# Altium schematic sheet Dashboard.SchDoc
size A; DocumentNumber: 10; SheetNumber: 10; SheetTotal: 12
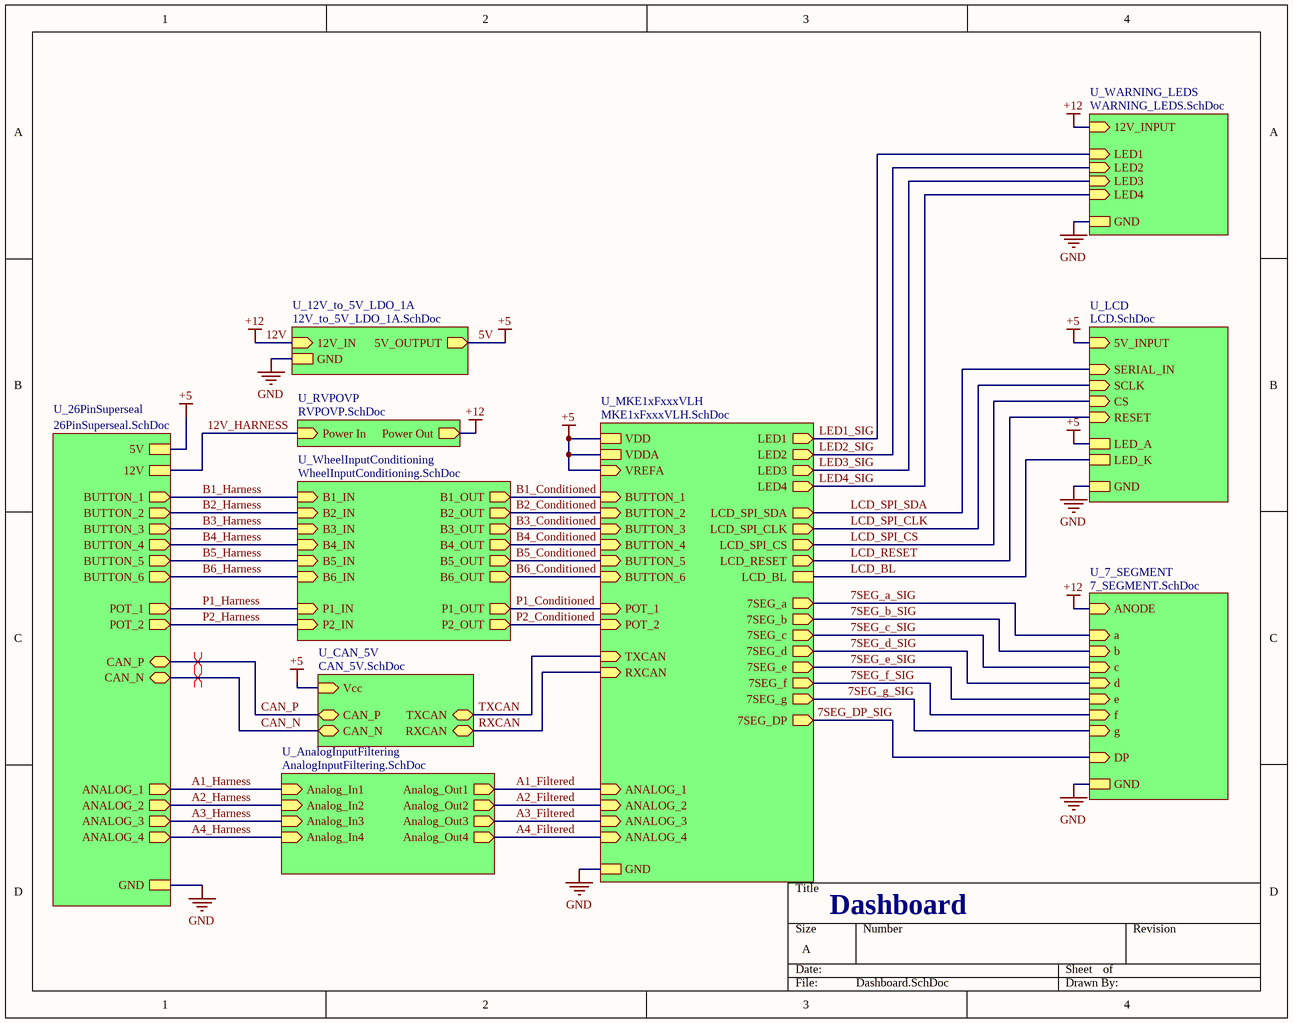
[diagram p0: Dashboard.SchDoc]

## Sub-sheets
U_7_SEGMENT = 7_SEGMENT.SchDoc: GND, DP (in), ANODE (in), g (in), e (in), f (in), b (in), a (in), d (in), c (in)
U_12V_to_5V_LDO_1A = 12V_to_5V_LDO_1A.SchDoc: 12V_IN (in), GND, 5V_OUTPUT (out)
U_26PinSuperseal = 26PinSuperseal.SchDoc: GND, CAN_P (bidir), 12V, POT_2 (out), BUTTON_1 (out), BUTTON_2 (out), BUTTON_3 (out), POT_1 (out), BUTTON_4 (out), CAN_N (bidir), 5V, BUTTON_6 (out), BUTTON_5 (out), ANALOG_3 (out), ANALOG_1 (out), ANALOG_2 (out), ANALOG_4 (out)
U_AnalogInputFiltering = AnalogInputFiltering.SchDoc: Analog_In1 (in), Analog_In2 (in), Analog_In3 (in), Analog_In4 (in), Analog_Out1 (out), Analog_Out2 (out), Analog_Out3 (out), Analog_Out4 (out)
U_CAN_5V = CAN_5V.SchDoc: Vcc (in), CAN_N (bidir), CAN_P (bidir), TXCAN (bidir), RXCAN (bidir)
U_LCD = LCD.SchDoc: 5V_INPUT (in), GND, LED_A, LED_K, SCLK (in), CS (in), RESET (in), SERIAL_IN (in)
U_MKE1xFxxxVLH = MKE1xFxxxVLH.SchDoc: VDD, VDDA, VREFA (in), GND, POT_1 (in), BUTTON_4 (in), RXCAN (in), BUTTON_1 (in), BUTTON_2 (in), LED1 (out), TXCAN (in), LED4 (out), LED3 (out), LED2 (out), BUTTON_3 (in), POT_2 (in), LCD_RESET (out), LCD_SPI_CS (out), LCD_SPI_CLK (out), LCD_SPI_SDA (out), 7SEG_a (out), 7SEG_DP (out), 7SEG_e (out), 7SEG_f (out), 7SEG_d (out), 7SEG_g (out), 7SEG_c (out), 7SEG_b (out), LCD_BL, BUTTON_5 (in), BUTTON_6 (in), ANALOG_3 (in), ANALOG_1 (in), ANALOG_2 (in), ANALOG_4 (in)
U_RVPOVP = RVPOVP.SchDoc: Power Out (out), Power In (in)
U_WARNING_LEDS = WARNING_LEDS.SchDoc: GND, 12V_INPUT (in), LED1 (in), LED2 (in), LED3 (in), LED4 (in)
U_WheelInputConditioning = WheelInputConditioning.SchDoc: B1_IN (in), B2_IN (in), B3_IN (in), B4_IN (in), P1_IN (in), P2_IN (in), P2_OUT (out), P1_OUT (out), B4_OUT (out), B3_OUT (out), B2_OUT (out), B1_OUT (out), B6_IN (in), B5_OUT (out), B5_IN (in), B6_OUT (out)

## Nets
5V: sheet U_CAN_5V/Vcc, sheet U_MKE1xFxxxVLH/VDD, sheet U_MKE1xFxxxVLH/VDDA, sheet U_MKE1xFxxxVLH/VREFA, sheet U_LCD/5V_INPUT, sheet U_LCD/LED_A, sheet U_26PinSuperseal/5V, sheet U_12V_to_5V_LDO_1A/5V_OUTPUT  [also labelled +5]
12V: sheet U_7_SEGMENT/ANODE, sheet U_RVPOVP/Power Out, sheet U_WARNING_LEDS/12V_INPUT, sheet U_12V_to_5V_LDO_1A/12V_IN  [also labelled +12]
GND: sheet U_7_SEGMENT/GND, sheet U_WARNING_LEDS/GND, sheet U_MKE1xFxxxVLH/GND, sheet U_LCD/GND, sheet U_26PinSuperseal/GND, sheet U_12V_to_5V_LDO_1A/GND
7SEG_a_SIG: sheet U_7_SEGMENT/a, sheet U_MKE1xFxxxVLH/7SEG_a
7SEG_b_SIG: sheet U_7_SEGMENT/b, sheet U_MKE1xFxxxVLH/7SEG_b
7SEG_c_SIG: sheet U_7_SEGMENT/c, sheet U_MKE1xFxxxVLH/7SEG_c
7SEG_d_SIG: sheet U_7_SEGMENT/d, sheet U_MKE1xFxxxVLH/7SEG_d
7SEG_DP_SIG: sheet U_7_SEGMENT/DP, sheet U_MKE1xFxxxVLH/7SEG_DP
7SEG_e_SIG: sheet U_7_SEGMENT/e, sheet U_MKE1xFxxxVLH/7SEG_e
7SEG_f_SIG: sheet U_7_SEGMENT/f, sheet U_MKE1xFxxxVLH/7SEG_f
7SEG_g_SIG: sheet U_7_SEGMENT/g, sheet U_MKE1xFxxxVLH/7SEG_g
12V_HARNESS: sheet U_RVPOVP/Power In, sheet U_26PinSuperseal/12V
A1_Filtered: sheet U_MKE1xFxxxVLH/ANALOG_1, sheet U_AnalogInputFiltering/Analog_Out1
A1_Harness: sheet U_26PinSuperseal/ANALOG_1, sheet U_AnalogInputFiltering/Analog_In1
A2_Filtered: sheet U_MKE1xFxxxVLH/ANALOG_2, sheet U_AnalogInputFiltering/Analog_Out2
A2_Harness: sheet U_26PinSuperseal/ANALOG_2, sheet U_AnalogInputFiltering/Analog_In2
A3_Filtered: sheet U_MKE1xFxxxVLH/ANALOG_3, sheet U_AnalogInputFiltering/Analog_Out3
A3_Harness: sheet U_26PinSuperseal/ANALOG_3, sheet U_AnalogInputFiltering/Analog_In3
A4_Filtered: sheet U_MKE1xFxxxVLH/ANALOG_4, sheet U_AnalogInputFiltering/Analog_Out4
A4_Harness: sheet U_26PinSuperseal/ANALOG_4, sheet U_AnalogInputFiltering/Analog_In4
B1_Conditioned: sheet U_MKE1xFxxxVLH/BUTTON_1, sheet U_WheelInputConditioning/B1_OUT
B1_Harness: sheet U_WheelInputConditioning/B1_IN, sheet U_26PinSuperseal/BUTTON_1
B2_Conditioned: sheet U_MKE1xFxxxVLH/BUTTON_2, sheet U_WheelInputConditioning/B2_OUT
B2_Harness: sheet U_WheelInputConditioning/B2_IN, sheet U_26PinSuperseal/BUTTON_2
B3_Conditioned: sheet U_MKE1xFxxxVLH/BUTTON_3, sheet U_WheelInputConditioning/B3_OUT
B3_Harness: sheet U_WheelInputConditioning/B3_IN, sheet U_26PinSuperseal/BUTTON_3
B4_Conditioned: sheet U_MKE1xFxxxVLH/BUTTON_4, sheet U_WheelInputConditioning/B4_OUT
B4_Harness: sheet U_WheelInputConditioning/B4_IN, sheet U_26PinSuperseal/BUTTON_4
B5_Conditioned: sheet U_MKE1xFxxxVLH/BUTTON_5, sheet U_WheelInputConditioning/B5_OUT
B5_Harness: sheet U_WheelInputConditioning/B5_IN, sheet U_26PinSuperseal/BUTTON_5
B6_Conditioned: sheet U_MKE1xFxxxVLH/BUTTON_6, sheet U_WheelInputConditioning/B6_OUT
B6_Harness: sheet U_WheelInputConditioning/B6_IN, sheet U_26PinSuperseal/BUTTON_6
CAN_N: sheet U_CAN_5V/CAN_N, sheet U_26PinSuperseal/CAN_N
CAN_P: sheet U_CAN_5V/CAN_P, sheet U_26PinSuperseal/CAN_P
LCD_BL: sheet U_MKE1xFxxxVLH/LCD_BL, sheet U_LCD/LED_K
LCD_RESET: sheet U_MKE1xFxxxVLH/LCD_RESET, sheet U_LCD/RESET
LCD_SPI_CLK: sheet U_MKE1xFxxxVLH/LCD_SPI_CLK, sheet U_LCD/SCLK
LCD_SPI_CS: sheet U_MKE1xFxxxVLH/LCD_SPI_CS, sheet U_LCD/CS
LCD_SPI_SDA: sheet U_MKE1xFxxxVLH/LCD_SPI_SDA, sheet U_LCD/SERIAL_IN
LED1_SIG: sheet U_WARNING_LEDS/LED1, sheet U_MKE1xFxxxVLH/LED1
LED2_SIG: sheet U_WARNING_LEDS/LED2, sheet U_MKE1xFxxxVLH/LED2
LED3_SIG: sheet U_WARNING_LEDS/LED3, sheet U_MKE1xFxxxVLH/LED3
LED4_SIG: sheet U_WARNING_LEDS/LED4, sheet U_MKE1xFxxxVLH/LED4
P1_Conditioned: sheet U_MKE1xFxxxVLH/POT_1, sheet U_WheelInputConditioning/P1_OUT
P1_Harness: sheet U_WheelInputConditioning/P1_IN, sheet U_26PinSuperseal/POT_1
P2_Conditioned: sheet U_MKE1xFxxxVLH/POT_2, sheet U_WheelInputConditioning/P2_OUT
P2_Harness: sheet U_WheelInputConditioning/P2_IN, sheet U_26PinSuperseal/POT_2
RXCAN: sheet U_CAN_5V/RXCAN, sheet U_MKE1xFxxxVLH/RXCAN
TXCAN: sheet U_CAN_5V/TXCAN, sheet U_MKE1xFxxxVLH/TXCAN

## Layout directives
differential pair: CAN_N, CAN_P

## Notes on the sheet
- Dashboard